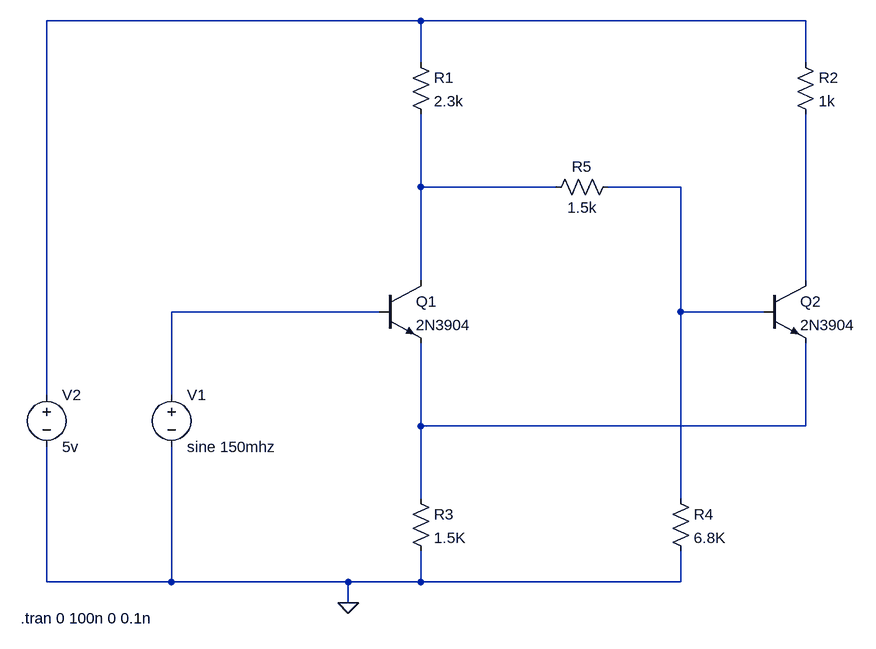
[diagram p0: schematic AC 09.asc]
AC 09.asc, the LTspice schematic file:
Version 4
SHEET 1 1608 760
WIRE 848 -416 272 -416
WIRE 1440 -416 848 -416
WIRE 848 -352 848 -416
WIRE 1440 -352 1440 -416
WIRE 848 -160 848 -272
WIRE 1056 -160 848 -160
WIRE 1248 -160 1136 -160
WIRE 848 -16 848 -160
WIRE 1440 -16 1440 -272
WIRE 784 32 464 32
WIRE 1248 32 1248 -160
WIRE 1376 32 1248 32
WIRE 272 160 272 -416
WIRE 464 160 464 32
WIRE 848 208 848 80
WIRE 1440 208 1440 80
WIRE 1440 208 848 208
WIRE 848 320 848 208
WIRE 1248 320 1248 32
WIRE 272 448 272 240
WIRE 464 448 464 240
WIRE 464 448 272 448
WIRE 736 448 464 448
WIRE 848 448 848 400
WIRE 848 448 736 448
WIRE 1248 448 1248 400
WIRE 1248 448 848 448
WIRE 736 480 736 448
FLAG 736 480 0
SYMBOL res 832 -368 R0
SYMATTR InstName R1
SYMATTR Value 2.3k
SYMBOL res 1424 -368 R0
SYMATTR InstName R2
SYMATTR Value 1k
SYMBOL res 832 304 R0
SYMATTR InstName R3
SYMATTR Value 1.5K
SYMBOL res 1232 304 R0
SYMATTR InstName R4
SYMATTR Value 6.8K
SYMBOL res 1152 -176 R90
WINDOW 0 0 56 VBottom 2
WINDOW 3 32 56 VTop 2
SYMATTR InstName R5
SYMATTR Value 1.5k
SYMBOL npn 784 -16 R0
SYMATTR InstName Q1
SYMATTR Value 2N3904
SYMBOL npn 1376 -16 R0
SYMATTR InstName Q2
SYMATTR Value 2N3904
SYMBOL voltage 464 144 R0
SYMATTR InstName V1
SYMATTR Value sine 150mhz
SYMBOL voltage 272 144 R0
SYMATTR InstName V2
SYMATTR Value 5v
TEXT 232 504 Left 2 !.tran 0 100n 0 0.1n

The netlist it stands for:
* AC 09.asc
R1 N001 N002 2.3k
R2 N001 N004 1k
R3 N006 0 1.5K
R4 N003 0 6.8K
R5 N003 N002 1.5k
Q1 N002 N005 N006 0 2N3904
Q2 N004 N003 N006 0 2N3904
V1 N005 0 sine 150mhz
V2 N001 0 5v
.model NPN NPN
.model PNP PNP
.lib standard.bjt
.tran 0 100n 0 0.1n
.backanno
.end